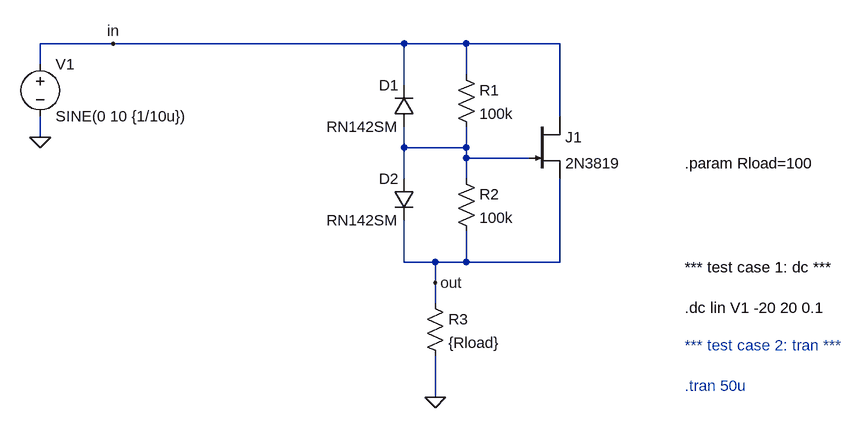
[diagram p0: schematic 092-bidirectional-current-limiter.asc]
092-bidirectional-current-limiter.asc, the LTspice schematic file:
Version 4
SHEET 1 880 680
WIRE -448 -32 -560 -32
WIRE 0 -32 -448 -32
WIRE 96 -32 0 -32
WIRE 240 -32 96 -32
WIRE -560 0 -560 -32
WIRE 96 16 96 -32
WIRE 0 32 0 -32
WIRE 240 80 240 -32
WIRE -560 112 -560 80
WIRE 0 128 0 96
WIRE 96 128 96 96
WIRE 96 128 0 128
WIRE 96 144 96 128
WIRE 192 144 96 144
WIRE 0 176 0 128
WIRE 96 176 96 144
WIRE 0 304 0 240
WIRE 48 304 0 304
WIRE 96 304 96 256
WIRE 96 304 48 304
WIRE 240 304 240 176
WIRE 240 304 96 304
WIRE 48 336 48 304
WIRE 48 368 48 336
WIRE 48 512 48 448
FLAG -560 112 0
FLAG 48 512 0
FLAG -448 -32 in
FLAG 48 336 out
SYMBOL njf 192 80 R0
SYMATTR InstName J1
SYMATTR Value 2N3819
SYMBOL res 80 0 R0
SYMATTR InstName R1
SYMATTR Value 100k
SYMBOL res 80 160 R0
SYMATTR InstName R2
SYMATTR Value 100k
SYMBOL diode 16 96 R180
WINDOW 0 24 64 Left 2
WINDOW 3 24 0 Left 2
SYMATTR InstName D1
SYMATTR Value RN142SM
SYMBOL diode 16 176 M0
SYMATTR InstName D2
SYMATTR Value RN142SM
SYMBOL voltage -560 -16 R0
WINDOW 123 0 0 Left 0
WINDOW 39 0 0 Left 0
SYMATTR InstName V1
SYMATTR Value SINE(0 10 {1/10u})
SYMBOL res 32 352 R0
SYMATTR InstName R3
SYMATTR Value {Rload}
TEXT 432 152 Left 2 !.param Rload=100
TEXT 432 312 Left 2 !*** test case 1: dc ***\n \n.dc lin V1 -20 20 0.1
TEXT 432 432 Left 2 ;*** test case 2: tran ***\n \n.tran 50u

The netlist it stands for:
* 092-bidirectional-current-limiter.asc
J1 in N001 out 2N3819
R1 in N001 100k
R2 N001 out 100k
D1 N001 in RN142SM
D2 N001 out RN142SM
V1 in 0 SINE(0 10 {1/10u})
R3 out 0 {Rload}
.model D D
.lib standard.dio
.model NJF NJF
.model PJF PJF
.lib standard.jft
.param Rload=100
*** test case 1: dc ***
.dc lin V1 -20 20 0.1
* *** test case 2: tran ***
* .tran 50u
.backanno
.end